# EAGLE design pcb_3 (EAGLE 5.06)
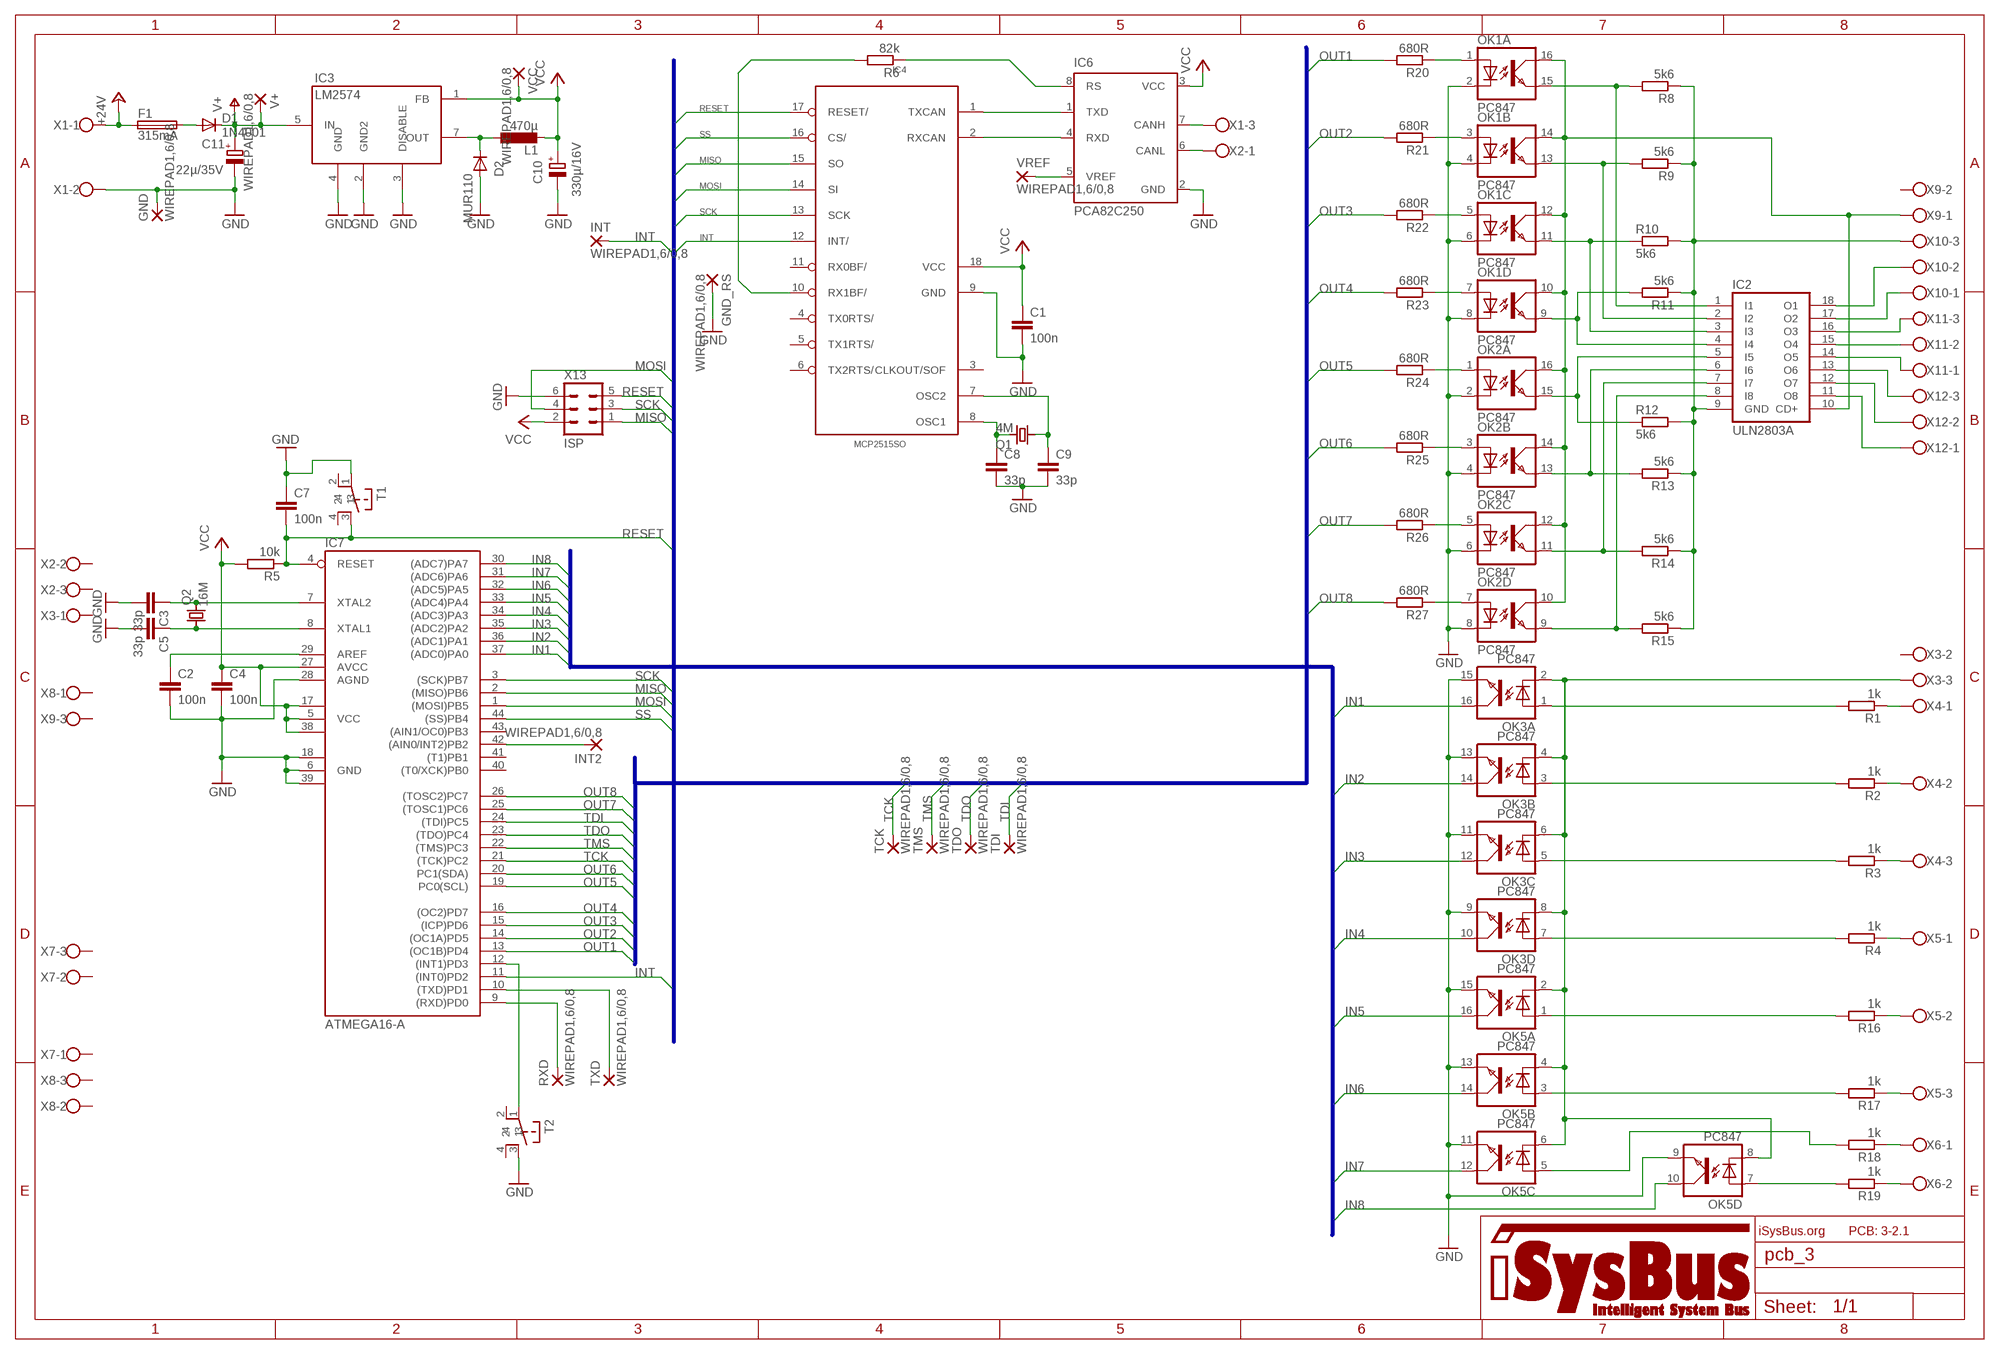
[diagram p0: schematic, sheet 1]

## Parts
C1  100n  C025-025X050  [C025-025X050]
C2  100n  C025-025X050  [C025-025X050]
C3  33p  C025-025X050  [C025-025X050]
C4  100n  C025-025X050  [C025-025X050]
C5  33p  C025-025X050  [C025-025X050]
C7  100n  C025-025X050  [C025-025X050]
C8  33p  C025-025X050  [C025-025X050]
C9  33p  C025-025X050  [C025-025X050]
C10  330µ/16V  CPOLE3.5-8  [E3,5-8]
C11  22µ/35V  CPOLE2-5  [E2-5]
D1  1N4001  [DO41-10]
D2  MUR110  [DO41-10]
F1  315mA  19560  [19560]
GND  WIREPAD1,6/0,8  [1,6/0,8]
GND_RS  WIREPAD1,6/0,8  [1,6/0,8]
IC2  ULN2803A  [DIL18]
IC3  LM2574  LM2574DIL08  [DIL08]
IC4  MCP2515SO  [SO18L]
IC6  PCA82C250  [DIL08]
IC7  ATMEGA16-A  [TQFP44]
INT  WIREPAD1,6/0,8  [1,6/0,8]
INT2  WIREPAD1,6/0,8  [1,6/0,8]
L1  470µ  L-0207/12  [0207/12]
OK1  PC847  [DIL16]
OK2  PC847  [DIL16]
OK3  PC847  [DIL16]
OK5  PC847  [DIL16]
Q1  4M  Q  [HC49U-V]
Q2  16M  Q  [HC49U-V]
R1  1k  R-R0805  [R0805]
R2  1k  R-R0805  [R0805]
R3  1k  R-R0805  [R0805]
R4  1k  R-R0805  [R0805]
R5  10k  R-0207/10  [0207/10]
R6  82k  R-0207/10  [0207/10]
R8  5k6  R-R0805  [R0805]
R9  5k6  R-R0805  [R0805]
R10  5k6  R-R0805  [R0805]
R11  5k6  R-R0805  [R0805]
R12  5k6  R-R0805  [R0805]
R13  5k6  R-R0805  [R0805]
R14  5k6  R-R0805  [R0805]
R15  5k6  R-R0805  [R0805]
R16  1k  R-R0805  [R0805]
R17  1k  R-R0805  [R0805]
R18  1k  R-R0805  [R0805]
R19  1k  R-R0805  [R0805]
R20  680R  R-R0805  [R0805]
R21  680R  R-R0805  [R0805]
R22  680R  R-R0805  [R0805]
R23  680R  R-R0805  [R0805]
R24  680R  R-R0805  [R0805]
R25  680R  R-R0805  [R0805]
R26  680R  R-R0805  [R0805]
R27  680R  R-R0805  [R0805]
RXD  WIREPAD1,6/0,8  [1,6/0,8]
T1  PHAP3301  [PHAP3301]
T2  PHAP3301  [PHAP3301]
TCK  WIREPAD1,6/0,8  [1,6/0,8]
TDI  WIREPAD1,6/0,8  [1,6/0,8]
TDO  WIREPAD1,6/0,8  [1,6/0,8]
TMS  WIREPAD1,6/0,8  [1,6/0,8]
TXD  WIREPAD1,6/0,8  [1,6/0,8]
U$1  ISYSBUS_LOGO  [ISYSBUS_LOGO]
U$2  FIELD_ISB_PLACE  [FIELD_ISB_PLACE]
U$4  3-2.1  FIELD_PCB_PLACE  [FIELD_PCB_PLACE]
V+  WIREPAD1,6/0,8  [1,6/0,8]
VCC  WIREPAD1,6/0,8  [1,6/0,8]
VREF  WIREPAD1,6/0,8  [1,6/0,8]
X1  AKL-03_073-03  [AKL-03]
X2  AKL-03_073-03  [AKL-03]
X3  AKL-03_073-03  [AKL-03]
X4  AKL-03_073-03  [AKL-03]
X5  AKL-03_073-03  [AKL-03]
X6  AKL-02_073-02  [AKL-02]
X7  AKL-03_073-03  [AKL-03]
X8  AKL-03_073-03  [AKL-03]
X9  AKL-03_073-03  [AKL-03]
X10  AKL-03_073-03  [AKL-03]
X11  AKL-03_073-03  [AKL-03]
X12  AKL-03_073-03  [AKL-03]
X13  ISP  ML6  [ML6]

## Nets
+24V: F1.1 X1.1
GND: C1.2 C2.2 C3.2 C4.2 C5.2 C7.1 C8.2 C9.2 C10.- C11.- D2.A GND.1(P) GND_RS.1(P) IC3.2(GND2) IC3.3(DISABLE) IC3.4(GND) IC4.9(GND) IC6.2(GND) IC7.6(GND) IC7.18(GND1) IC7.28(AGND) IC7.39(GND2) OK1.2(A:C) OK1.4(B:C) OK1.6(C:C) OK1.8(D:C) OK2.2(A:C) OK2.4(B:C) OK2.6(C:C) OK2.8(D:C) OK3.9(D:EMIT) OK3.11(C:EMIT) OK3.13(B:EMIT) OK3.15(A:EMIT) OK5.9(D:EMIT) OK5.11(C:EMIT) OK5.13(B:EMIT) OK5.15(A:EMIT) T1.1 T2.3 X1.2 X13.6
GND1: IC2.9(GND) R8.1 R9.1 R10.2 R11.1 R12.2 R13.1 R14.1 R15.1 X10.3
GND2: OK3.2(A:C) OK3.4(B:C) OK3.6(C:C) OK3.8(D:C) OK5.2(A:C) OK5.4(B:C) OK5.6(C:C) OK5.8(D:C) X3.3
IN1: IC7.37((ADC0)PA0) OK3.16(A:COL)
IN2: IC7.36((ADC1)PA1) OK3.14(B:COL)
IN3: IC7.35((ADC2)PA2) OK3.12(C:COL)
IN4: IC7.34((ADC3)PA3) OK3.10(D:COL)
IN5: IC7.33((ADC4)PA4) OK5.16(A:COL)
IN6: IC7.32((ADC5)PA5) OK5.14(B:COL)
IN7: IC7.31((ADC6)PA6) OK5.12(C:COL)
IN8: IC7.30((ADC7)PA7) OK5.10(D:COL)
INT: IC4.12(INT/) IC7.11((INT0)PD2) INT.1(P)
MISO: IC4.15(SO) IC7.2((MISO)PB6) X13.1
MOSI: IC4.14(SI) IC7.1((MOSI)PB5) X13.4
N$1: IC2.14(O5) X11.1
N$2: IC2.13(O6) X12.3
N$3: IC2.12(O7) X12.2
N$4: IC2.11(O8) X12.1
N$5: IC2.15(O4) X11.2
N$6: IC2.16(O3) X11.3
N$7: IC2.17(O2) X10.1
N$8: IC2.18(O1) X10.2
N$9: C5.1 IC7.8(XTAL1) Q2.1
N$10: R19.1 X6.2
N$11: R18.1 X6.1
N$12: OK1.7(D:A) R23.1
N$13: IC2.8(I8) OK2.9(D:EMIT) R15.2
N$14: IC2.7(I7) OK2.11(C:EMIT) R14.2
N$15: IC2.6(I6) OK2.13(B:EMIT) R13.2
N$16: IC2.5(I5) OK2.15(A:EMIT) R12.1
N$17: IC2.4(I4) OK1.9(D:EMIT) R11.2
N$18: D1.A F1.2
N$19: IC2.3(I3) OK1.11(C:EMIT) R10.1
N$20: IC2.2(I2) OK1.13(B:EMIT) R9.2
N$21: IC2.1(I1) OK1.15(A:EMIT) R8.2
N$22: R17.1 X5.3
N$23: R16.1 X5.2
N$24: R4.1 X5.1
N$25: R3.1 X4.3
N$26: R1.1 X4.1
N$27: R2.1 X4.2
N$28: OK5.7(D:A) R19.2
N$29: OK5.5(C:A) R18.2
N$30: OK5.3(B:A) R17.2
N$31: OK5.1(A:A) R16.2
N$32: OK3.7(D:A) R4.2
N$33: OK3.5(C:A) R3.2
N$34: OK3.3(B:A) R2.2
N$35: OK3.1(A:A) R1.2
N$36: C2.1 IC7.29(AREF)
N$37: OK1.5(C:A) R22.1
N$38: OK1.3(B:A) R21.1
N$40: OK1.1(A:A) R20.1
N$41: OK2.1(A:A) R24.1
N$42: OK2.3(B:A) R25.1
N$43: OK2.5(C:A) R26.1
N$44: IC6.7(CANH) X1.3
N$45: IC6.6(CANL) X2.1
N$46: C8.1 IC4.8(OSC1) Q1.2
N$47: IC7.12((INT1)PD3) T2.1
N$48: IC7.42((AIN0/INT2)PB2) INT2.1(P)
N$49: C9.1 IC4.7(OSC2) Q1.1
N$50: IC4.10(RX1BF/) R6.2
N$51: IC7.10((TXD)PD1) TXD.1(P)
N$52: D2.C IC3.7(OUT) L1.1
N$53: IC7.9((RXD)PD0) RXD.1(P)
N$54: IC6.8(RS) R6.1
N$55: C3.1 IC7.7(XTAL2) Q2.2
N$56: IC6.5(VREF) VREF.1(P)
N$62: OK2.7(D:A) R27.1
N$63: IC2.10(CD+) OK1.10(D:COL) OK1.12(C:COL) OK1.14(B:COL) OK1.16(A:COL) OK2.10(D:COL) OK2.12(C:COL) OK2.14(B:COL) OK2.16(A:COL) X9.1
OUT1: IC7.13((OC1B)PD4) R20.2
OUT2: IC7.14((OC1A)PD5) R21.2
OUT3: IC7.15((ICP)PD6) R22.2
OUT4: IC7.16((OC2)PD7) R23.2
OUT5: IC7.19(PC0(SCL)) R24.2
OUT6: IC7.20(PC1(SDA)) R25.2
OUT7: IC7.25((TOSC1)PC6) R26.2
OUT8: IC7.26((TOSC2)PC7) R27.2
RESET: C7.2 IC4.17(RESET/) IC7.4(RESET) R5.1 T1.3 X13.5
RXCAN: IC4.2(RXCAN) IC6.4(RXD)
SCK: IC4.13(SCK) IC7.3((SCK)PB7) X13.3
SS: IC4.16(CS/) IC7.44((SS)PB4)
TCK: IC7.21((TCK)PC2) TCK.1(P)
TDI: IC7.24((TDI)PC5) TDI.1(P)
TDO: IC7.23((TDO)PC4) TDO.1(P)
TMS: IC7.22((TMS)PC3) TMS.1(P)
TXCAN: IC4.1(TXCAN) IC6.1(TXD)
V+: C11.+ D1.C IC3.5(IN) V+.1(P)
VCC: C1.1 C4.1 C10.+ IC3.1(FB) IC4.18(VCC) IC6.3(VCC) IC7.5(VCC) IC7.17(VCC1) IC7.27(AVCC) IC7.38(VCC2) L1.2 R5.2 VCC.1(P) X13.2
Unconnected: IC4.3(CLKOUT/SOF) IC4.4(TX0RTS/) IC4.5(TX1RTS/) IC4.6(TX2RTS/) IC4.11(RX0BF/) IC7.40((T0/XCK)PB0) IC7.41((T1)PB1) IC7.43((AIN1/OC0)PB3) T1.2 T1.4 T2.2 T2.4 X2.2 X2.3 X3.1 X3.2 X7.1 X7.2 X7.3 X8.1 X8.2 X8.3 X9.2 X9.3

## Buses
SCK,MOSI,MISO,SS,RESET,INT
IN[1..8]
OUT[1..8],TDI,TDO,TMS,TCK

## Library data of the parts
C1-C5 C7-C9 = isb_capacitors:C: CAPACITOR, European symbol
C10 C11 = isb_capacitors:CPOL: POLARIZED CAPACITOR, European symbol
D1 = isb_diodes:1N4001
D2 = isb_diodes:MUR110
F1 = isb_supply:19560: FUSE HOLDER TR5, Wickmann
GND GND_RS INT INT2 RXD TCK TDI TDO TMS TXD V+ VCC VREF = isb_connectors:WIREPAD: Wire PAD connect wire on PCB
IC2 = isb_transistors:ULN2803A: DRIVER ARRAY
IC3 = isb_supply:LM2574
IC4 = isb_interfacecontrollers:MCP2515
IC6 = isb_interfacecontrollers:PCA82C250
IC7 = isb_microcontrollers:ATMEGA16
L1 = isb_inductors:L: INDUCTOR, European symbol
OK1-OK3 OK5 = isb_optical:PC847: Optocoupler: PC847 Order numbers (DIP16): - Reichelt: PC 847X - CSD-Electronics: N/A
Q1 Q2 = isb_oscillators:Q
R1-R6 R8-R27 = isb_resistors:R: RESISTOR, European symbol
T1 T2 = isb_buttons:PHAP3301
U$1 = hausbus:ISYSBUS_LOGO
U$2 = isb_misc:FIELD_ISB
U$4 = isb_misc:FIELD_PCB
X1-X5 X7-X12 = isb_connectors:AKL-03_: WAGO SREW CLAMP
X6 = isb_connectors:AKL-02_: WAGO SREW CLAMP
X13 = isb_connectors:ML6: HARTING

## Board
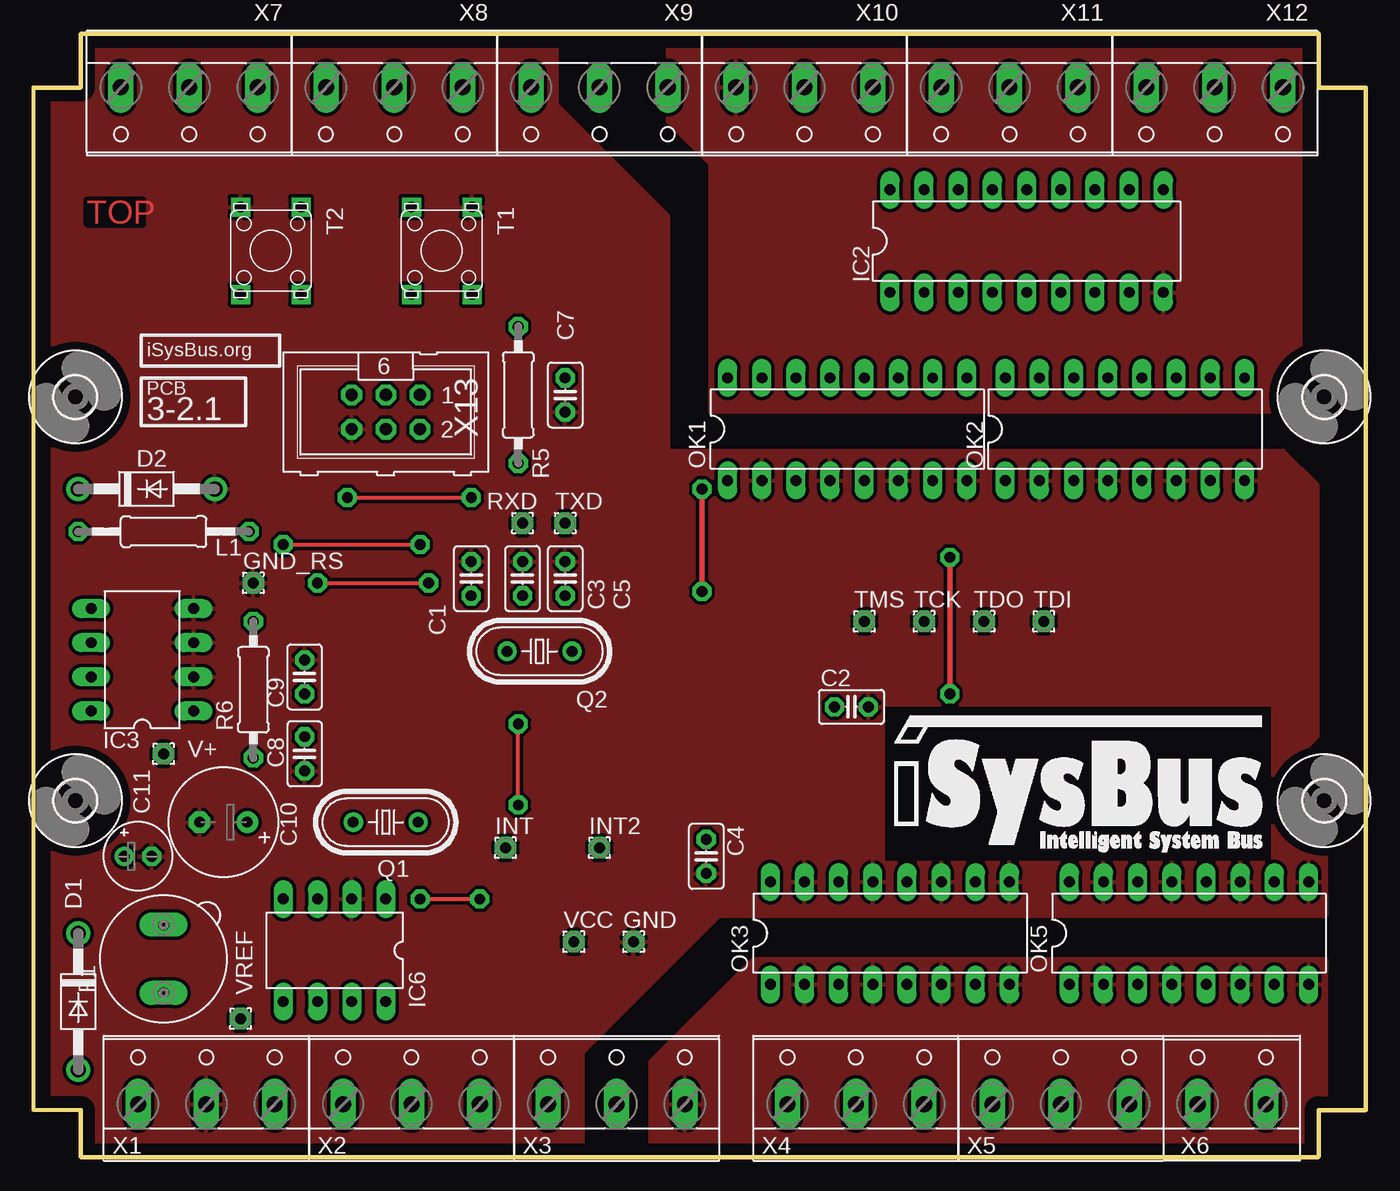
[diagram p1: board, top side]
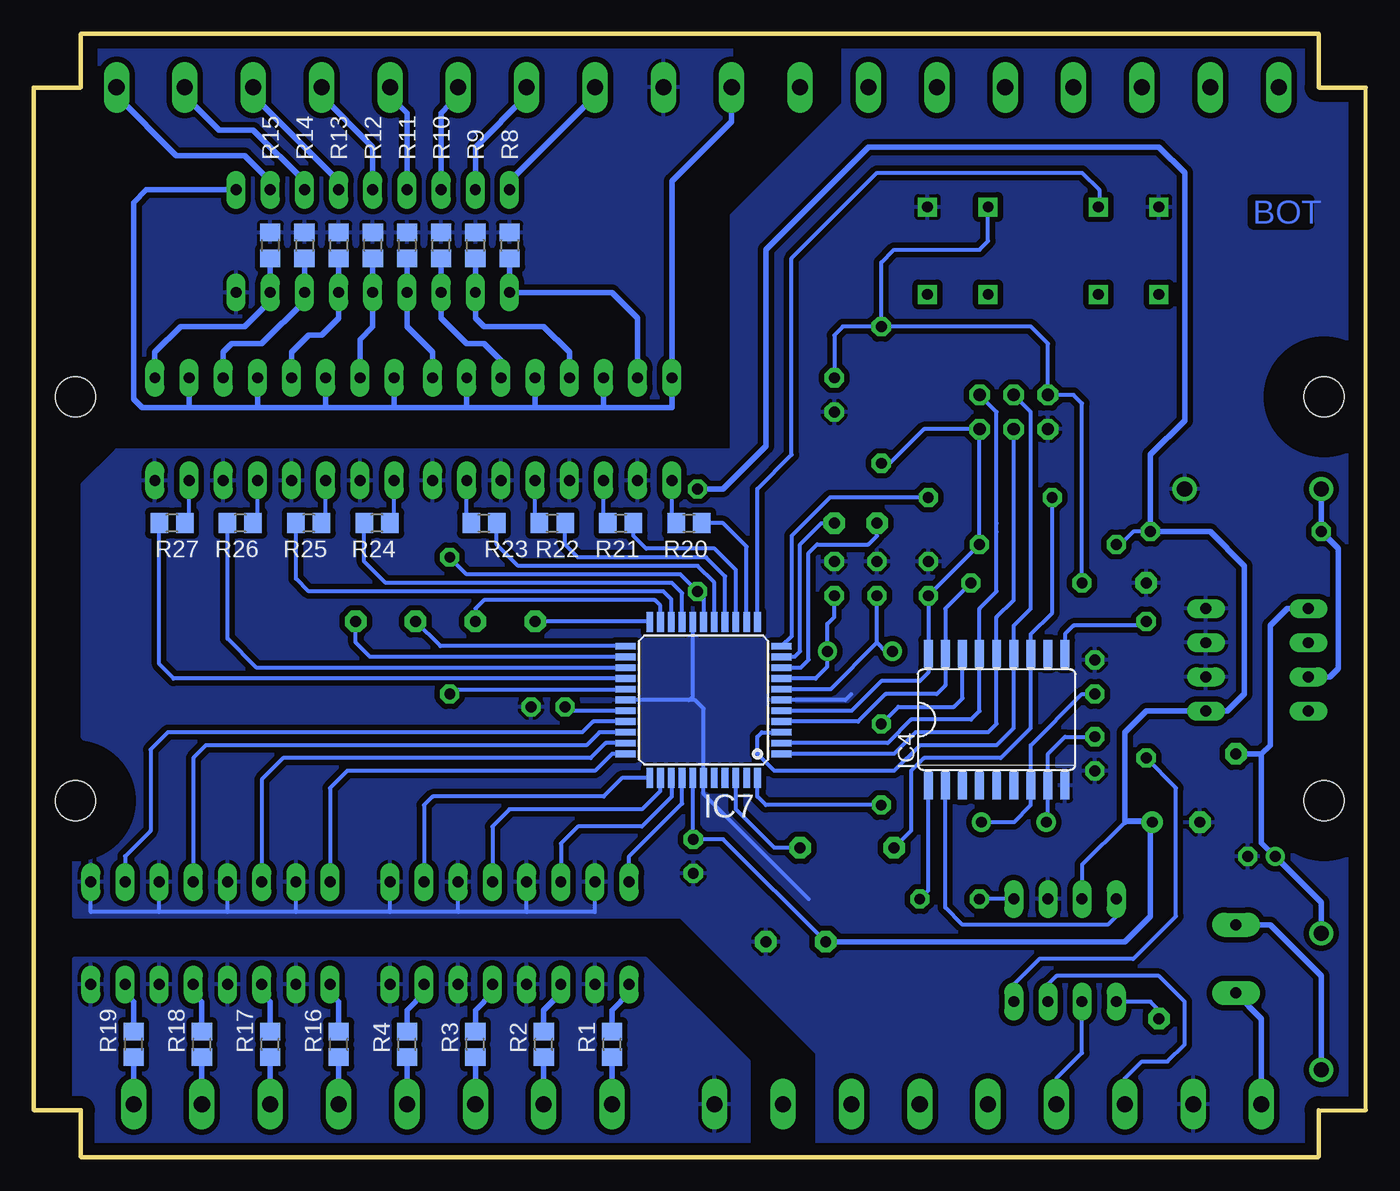
[diagram p2: board, bottom side, seen from below]

Size 99 x 83.5 mm. Coordinates in mm from the lower left corner, seen from the top.
Outline: 3.5,3.5 3.5,0 95.5,0 95.5,3.5 99,3.5 99,79.5 95.5,79.5 95.5,83.5 3.5,83.5 3.5,79.5 0,79.5 0,3.5 3.5,3.5
Copper layers (1*16): Top 0.035mm / dielectric 1.5mm / Bottom 0.035mm
Design rules "hausbus *": minimum track width 12mil, minimum drill 31mil, track to track 10mil, track to pad 10mil, pad to pad 10mil, via to via 10mil, smd to smd 8mil, copper to edge 35mil, drill to drill 8mil, minimum pad ring 12mil, minimum via ring 12mil, stop-mask expansion 6mil, vias tented up to drill 0mil, thermal gap 10mil
tKeepout: area 0,79.5 to 3.5,83.5; area 0,0 to 3.5,3.5
bKeepout: area 0,79.5 to 3.5,83.5; area 0,0 to 3.5,3.5
tRestrict: area 95.5,0 to 99,3.5
bRestrict: area 95.5,0 to 99,3.5
Milling: 12 lines

### Footprints (pad centres in the part's own frame; a part is rotated, then mirrored left to right if it is on the bottom)
C025-025X050 = drill 0.813 octagon: 1 -1.27,0; 2 1.27,0
E3,5-8 = drill 0.813 pad 1.6 round: + -1.778,0 | drill 0.813 pad 1.6 octagon: - 1.778,0
E2-5 = drill 0.813 pad 1.27 round: + -1.016,0 | drill 0.813 pad 1.27 octagon: - 1.016,0
DO41-10 = drill 1.118 round: A 5.08,0; C -5.08,0
19560 = drill 0.813 pad 1.778 long: 1 -2.54,0; 2 2.54,0
1,6/0,8 = drill 0.813 pad 1.6 octagon: 1 0,0
DIL18 = drill 0.813 long: 1 -10.16,-3.81; 2 -7.62,-3.81; 3 -5.08,-3.81; 4 -2.54,-3.81; 5 0,-3.81; 6 2.54,-3.81; 7 5.08,-3.81; 8 7.62,-3.81; 9 10.16,-3.81; 10 10.16,3.81; 11 7.62,3.81; 12 5.08,3.81; 13 2.54,3.81; 14 0,3.81; 15 -2.54,3.81; 16 -5.08,3.81; 17 -7.62,3.81; 18 -10.16,3.81
DIL08 = drill 0.813 long: 1 -3.81,-3.81; 2 -1.27,-3.81; 3 1.27,-3.81; 4 3.81,-3.81; 5 3.81,3.81; 6 1.27,3.81; 7 -1.27,3.81; 8 -3.81,3.81
SO18L = smd 0.66 x 2.032: 1 -5.08,-4.902; 2 -3.81,-4.902; 3 -2.54,-4.902; 4 -1.27,-4.902; 5 0,-4.902; 6 1.27,-4.902; 7 2.54,-4.902; 8 3.81,-4.902; 9 5.08,-4.902; 10 5.08,4.902; 11 3.81,4.902; 12 2.54,4.902; 13 1.27,4.902; 14 0,4.902; 15 -1.27,4.902; 16 -2.54,4.902; 17 -3.81,4.902; 18 -5.08,4.902
TQFP44 = smd 1.5 x 0.5: 1 -5.8,4; 2 -5.8,3.2; 3 -5.8,2.4; 4 -5.8,1.6; 5 -5.8,0.8; 6 -5.8,0; 7 -5.8,-0.8; 8 -5.8,-1.6; 9 -5.8,-2.4; 10 -5.8,-3.2; 11 -5.8,-4; 23 5.8,-4; 24 5.8,-3.2; 25 5.8,-2.4; 26 5.8,-1.6; 27 5.8,-0.8; 28 5.8,0; 29 5.8,0.8; 30 5.8,1.6; 31 5.8,2.4; 32 5.8,3.2; 33 5.8,4 | smd 0.5 x 1.5: 12 -4,-5.8; 13 -3.2,-5.8; 14 -2.4,-5.8; 15 -1.6,-5.8; 16 -0.8,-5.8; 17 0,-5.8; 18 0.8,-5.8; 19 1.6,-5.8; 20 2.4,-5.8; 21 3.2,-5.8; 22 4,-5.8; 34 4,5.8; 35 3.2,5.8; 36 2.4,5.8; 37 1.6,5.8; 38 0.8,5.8; 39 0,5.8; 40 -0.8,5.8; 41 -1.6,5.8; 42 -2.4,5.8; 43 -3.2,5.8; 44 -4,5.8
0207/12 = drill 0.813 octagon: 1 -6.35,0; 2 6.35,0
DIL16 = drill 0.813 long: 1 -8.89,-3.81; 2 -6.35,-3.81; 3 -3.81,-3.81; 4 -1.27,-3.81; 5 1.27,-3.81; 6 3.81,-3.81; 7 6.35,-3.81; 8 8.89,-3.81; 9 8.89,3.81; 10 6.35,3.81; 11 3.81,3.81; 12 1.27,3.81; 13 -1.27,3.81; 14 -3.81,3.81; 15 -6.35,3.81; 16 -8.89,3.81
HC49U-V = drill 0.813 round: 1 -2.413,0; 2 2.413,0
R0805 = smd 1.3 x 1.5: 1 -0.95,0; 2 0.95,0
0207/10 = drill 0.813 octagon: 1 -5.08,0; 2 5.08,0
PHAP3301 = drill 0.8 square: 1 0,4.5; 2 6.5,4.5; 3 0,0; 4 6.5,0
3,0 = hole 3: 0,0
AKL-03 = drill 1.194 long: 1 -5.08,-0.635; 2 0,-0.635; 3 5.08,-0.635
AKL-02 = drill 1.194 long: 1 -2.54,-0.635; 2 2.54,-0.635
ML6 = drill 0.914 octagon: 1 -2.54,-1.27; 2 -2.54,1.27; 3 0,-1.27; 4 0,1.27; 5 2.54,-1.27; 6 2.54,1.27

### Placement (x,y rotation side)
C1  32.52,43 90 top
C2  60.78,33.47 0 top
C3  36.33,43 90 top
C4  49.98,22.36 270 top
C5  39.51,43 90 top
C7  39.51,56.65 90 top
C8  20.14,29.98 270 top
C9  20.14,35.7 90 top
C10  14.11,24.9 180 top
C11  7.76,22.36 0 top
D1  3.31,11.56 270 top
D2  8.39,49.66 0 top
F1  9.66,14.74 90 top
GND  44.59,16.01 0 top
GND_RS  16.33,42.68 0 top
IC2  73.8,68.08 0 top
IC3  8.07,36.97 90 top
IC4  27.44,32.52 0 bottom
IC6  22.36,15.38 180 top
IC7  49.22,33.98 180 bottom
INT  35.06,23 0 top
INT2  42.05,23 0 top
L1  9.66,46.49 0 top
OK1  60.46,54.11 0 top
OK2  81.1,54.11 0 top
OK3  63.64,16.64 0 top
OK5  85.86,16.64 0 top
Q1  26.17,24.9 180 top
Q2  37.6,37.6 180 top
R1  56.02,8.39 90 bottom
R2  61.09,8.39 90 bottom
R3  66.17,8.39 90 bottom
R4  71.25,8.39 90 bottom
R5  36.01,56.65 270 top
R6  16.33,34.74 90 top
R8  63.64,67.76 270 bottom
R9  66.17,67.76 270 bottom
R10  68.72,67.76 90 bottom
R11  71.25,67.76 270 bottom
R12  73.8,67.76 90 bottom
R13  76.33,67.76 270 bottom
R14  78.88,67.76 270 bottom
R15  81.42,67.76 270 bottom
R16  76.33,8.39 90 bottom
R17  81.42,8.39 90 bottom
R18  86.5,8.39 90 bottom
R19  91.58,8.39 90 bottom
R20  50.3,47.12 0 bottom
R21  55.38,47.12 0 bottom
R22  60.46,47.12 0 bottom
R23  65.54,47.12 0 bottom
R24  73.48,47.12 180 bottom
R25  78.56,47.12 180 bottom
R26  83.64,47.12 180 bottom
R27  88.72,47.12 180 bottom
RXD  36.33,47.12 0 top
T1  28.07,70.62 270 top
T2  15.38,70.62 270 top
TCK  66.17,39.82 0 top
TDI  75.06,39.82 0 top
TDO  70.62,39.82 0 top
TMS  61.73,39.82 0 top
TXD  39.51,47.12 0 top
U$1  63.95,22.68 0 top
U$2  8.39,57.92 0 top
U$3  [3,0]  3.1,56.5 0 top
U$4  8.39,54.74 0 top
U$5  [3,0]  3.1,26.5 0 top
U$6  [3,0]  95.9,56.5 0 top
U$7  [3,0]  95.9,26.5 0 top
V+  9.66,29.98 0 top
VCC  40.14,16.01 0 top
VREF  15.38,10.29 0 top
X1  12.84,4.58 0 top
X2  28.07,4.58 0 top
X3  43.31,4.58 0 top
X4  61.09,4.58 0 top
X5  76.33,4.58 0 top
X6  89.03,4.58 0 top
X7  11.56,78.88 180 top
X8  26.8,78.88 180 top
X9  42.05,78.88 180 top
X10  57.28,78.88 180 top
X11  72.53,78.88 180 top
X12  87.77,78.88 180 top
X13  26.17,55.38 180 top

### Tracks (layer width: path | path; a pad name or v marks a point on that pad's centre or on a via)
+24V
  Bottom 0.406: X1.1 7.76,10.29 F1.1
GND
  Bottom 0.305: 89.67,18.23 94.75,18.23 OK5.9 94.75,21.73 | 89.67,18.23 OK5.11 | 84.59,18.23 89.67,18.23 | 84.59,18.23 OK5.13 | 79.51,18.23 84.59,18.23 | 79.51,21.09 OK5.15 79.51,18.23 | 72.53,18.23 79.51,18.23 | 72.53,18.23 OK3.9 | 67.44,18.23 72.53,18.23 | 67.44,18.23 OK3.11 | 62.37,18.23 67.44,18.23 | 62.37,18.23 OK3.13 | 62.37,18.23 57.28,18.23 OK3.15 | IC4.9 22.36,28.07 | IC7.6 38.68,33.98 38.23,34.42 | 50.3,33.98 49.85,33.98 49.22,33.34 IC7.39 49.22,26.99 41.41,19.18 | 50.3,33.98 IC7.28 | IC7.18 50.02,34.26 50.3,33.98
  pour Bottom (isolate 0.406): 1.41,82.69 38.87,82.69 38.87,78.24 47.12,69.98 47.12,52.52 92.84,52.52 95.39,49.98 95.39,31.25 93.48,29.34 93.48,24.9 96.02,22.36 96.02,17.91 50.94,17.91 40.77,7.76 40.77,0.77 1.41,0.77
  pour Top: 1.41,82.69 38.87,82.69 38.87,78.24 47.12,69.98 47.12,52.52 92.84,52.52 95.39,49.98 95.39,31.25 93.48,29.34 93.48,24.9 96.02,22.36 96.02,17.91 50.94,17.91 40.77,7.76 40.77,0.77 1.41,0.77
GND1
  pour Bottom (isolate 0.406): 47.12,82.69 94.11,82.69 94.11,55.38 50.3,55.38 50.3,73.8 47.12,76.97
  pour Top: 47.12,82.69 94.11,82.69 94.11,55.38 50.3,55.38 50.3,73.8 47.12,76.97
GND2
  pour Bottom (isolate 0.406): 45.85,0.77 45.85,7.12 53.48,14.74 96.02,14.74 96.02,0.77
  pour Top: 45.85,0.77 45.85,7.12 53.48,14.74 96.02,14.74 96.02,0.77
IN1
  Bottom 0.305: OK3.16 54.74,22.36 50.82,26.29 IC7.37
IN2
  Bottom 0.305: IC7.36 51.57,28.18 51.57,26.8 53.79,24.58 58.55,24.58 59.83,23.31 OK3.14
IN3
  Bottom 0.305: IC7.35 52.42,27.23 53.79,25.85 63.64,25.85 64.91,24.58 OK3.12
IN4
  Bottom 0.305: IC7.34 55.28,28.18 56.65,26.8 69.35,26.8 69.98,26.17 OK3.10
IN5
  Bottom 0.305: IC7.33 54.75,29.98 54.74,29.98 56.02,29.98 57.28,28.71 75.7,28.71 76.97,27.44 OK5.16
IN6
  Bottom 0.305: OK5.14 82.05,28.07 80.46,29.66 57.6,29.66 56.49,30.78 IC7.32
IN7
  Bottom 0.305: OK5.12 87.13,29.66 86.17,30.62 86.16,30.61 57.92,30.61 56.96,31.58 IC7.31
IN8
  Bottom 0.305: OK5.10 92.21,22.36 90.31,24.27 90.31,30.3 89.03,31.57 58.24,31.57 57.43,32.38 IC7.30
INT  (via drill 0.8)
  Top 0.305: v23.31,49.03 v32.52,49.03
  Bottom 0.305: v32.52,49.03 39.82,49.03 42.68,46.17 42.68,38.71 IC7.11 | INT.1 33.79,24.27 33.79,28.71 32.84,29.66 27.12,29.66 24.9,31.88 IC4.12 24.9,38.87 23.31,40.46 v23.31,49.03
MISO
  Bottom 0.305: 27.44,46.49 27.44,47.12 | X13.1 27.44,55.38 27.44,46.49 | IC7.2 35.53,30.78 33.79,32.52 29.34,32.52 28.71,33.16 IC4.15 28.71,40.77 27.44,42.05 27.44,46.49
MOSI
  Bottom 0.305: X13.4 26.17,41.41 27.44,40.14 IC4.14 27.44,32.2 28.07,31.57 33.47,31.57 35.06,29.98 37.6,29.98 IC7.1
N$1
  Bottom 0.406: IC2.14 73.8,75.06 77.61,78.88 X11.1
N$2
  Bottom 0.406: IC2.13 76.33,72.53 82.69,78.88 X12.3
N$3
  Bottom 0.406: IC2.12 78.88,72.53 82.69,76.33 85.22,76.33 87.77,78.88 X12.2
N$4
  Bottom 0.406: IC2.11 81.42,72.53 83.32,74.43 88.4,74.43 92.84,78.88 X12.1
N$5
  Bottom 0.305: 72.53,78.88 X11.2
  Bottom 0.406: IC2.15 71.25,77.61 72.53,78.88
N$6
  Bottom 0.406: IC2.16 68.72,77.61 68.08,78.24 68.08,78.88 X11.3
N$7
  Bottom 0.406: IC2.17 66.17,75.06 62.37,78.88 X10.1
N$8
  Bottom 0.406: IC2.18 63.64,72.53 57.28,78.88 X10.2
N$9
  Bottom 0.305: IC7.8 40.89,35.58 40.01,36.46 Q2.1 40.01,39.63 39.51,40.14 C5.1
N$10
  Bottom 0.305: R19.1 91.58,7.76
  Bottom 0.406: X6.2 R19.1
N$11
  Bottom 0.406: X6.1 R18.1
N$12
  Bottom 0.305: R23.1 66.81,47.45 OK1.7
N$13
  Bottom 0.406: R15.2 IC2.8 81.42,63.64 83.32,61.73 88.08,61.73 89.99,59.83 OK2.9
N$14
  Bottom 0.406: R14.2 IC2.7 78.88,63.64 82.05,60.46 84.27,60.46 84.91,59.83 OK2.11
N$15
  Bottom 0.406: R13.2 IC2.6 76.33,62.37 77.61,61.09 78.56,61.09 79.83,59.83 OK2.13
N$16
  Bottom 0.406: R12.1 IC2.5 73.8,61.73 74.75,60.78 OK2.15
N$17
  Bottom 0.406: IC2.4 71.25,63.64 | IC2.4 R11.2 | OK1.9 69.35,59.83 71.25,61.73 IC2.4
N$18
  Bottom 0.406: F1.2 7.12,17.28 3.31,13.47 D1.A
N$19
  Bottom 0.406: IC2.3 68.72,63.64 | IC2.3 R10.1 | IC2.3 68.72,62.37 66.81,60.46 65.54,60.46 64.27,59.19 OK1.11
N$20
  Bottom 0.406: R9.2 IC2.2 66.17,62.37 65.54,61.73 61.09,61.73 59.19,59.83 OK1.13
N$21
  Bottom 0.406: R8.2 IC2.1 56.02,64.27 54.11,62.37 OK1.15
N$22
  Bottom 0.406: X5.3 R17.1
N$23
  Bottom 0.406: X5.2 R16.1
N$24
  Bottom 0.406: X5.1 R4.1
N$25
  Bottom 0.406: X4.3 R3.1
N$26
  Bottom 0.406: X4.1 R1.1
N$27
  Bottom 0.406: X4.2 R2.1
N$28
  Bottom 0.406: R19.2 91.58,11.56 92.21,12.2 OK5.7
N$29
  Bottom 0.406: R18.2 86.5,11.56 87.13,12.2 OK5.5
N$30
  Bottom 0.406: R17.2 81.42,11.56 82.05,12.2 OK5.3
N$31
  Bottom 0.406: R16.2 76.33,11.56 76.97,12.2 OK5.1
N$32
  Bottom 0.406: R4.2 71.25,10.93 69.98,12.2 OK3.7
N$33
  Bottom 0.406: R3.2 66.17,10.93 64.91,12.2 OK3.5
N$34
  Bottom 0.406: R2.2 61.09,10.93 59.83,12.2 OK3.3
N$35
  Bottom 0.406: R1.2 56.02,10.93 54.74,12.2 OK3.1
N$36
  Bottom 0.305: C2.1 59.21,33.18 IC7.29
N$37
  Bottom 0.305: R22.1 61.73,47.45 OK1.5
N$38
  Bottom 0.305: R21.1 56.65,47.45 OK1.3
N$40
  Bottom 0.305: R20.1 51.57,47.45 OK1.1
N$41
  Bottom 0.305: R24.1 72.21,47.45 OK2.1
N$42
  Bottom 0.305: R25.1 77.29,47.45 OK2.3
N$43
  Bottom 0.305: R26.1 82.37,47.45 OK2.5
N$44
  Bottom 0.305: X1.3 17.91,5.85 16.64,7.12 14.74,7.12 13.47,8.39 13.47,11.56 15.38,13.47 23,13.47 23.63,12.84 IC6.7
N$45
  Bottom 0.305: X2.1 23,5.85 21.09,7.76 IC6.6
N$46
  Bottom 0.305: Q1.2 23.76,25.41 23.63,25.54 IC4.8 23.63,29.98 22.36,31.25 C8.1
N$47
  Bottom 0.305: IC7.12 45.22,49.66 42.68,52.2 42.68,66.81 36.33,73.16 21.09,73.16 19.82,71.89 19.82,70.62 T2.1
N$48
  Bottom 0.305: IC7.42 46.82,25.86 43.95,23 INT2.1
N$49
  Bottom 0.305: Q1.1 26.17,24.9 24.9,26.17 IC4.7 24.9,30.61 21.09,34.42 C9.1
N$50
  Bottom 0.305: IC4.10 22.36,38.87 21.73,39.51 16.33,39.51 R6.2
N$51
  Bottom 0.305: IC7.10 42.47,37.18 42.05,37.6 42.05,45.54 40.46,47.12 TXD.1
N$52
  Bottom 0.406: IC3.7 2.67,35.7 2.04,36.33 2.04,45.22 L1.1 D2.C
N$53
  Bottom 0.305: IC7.9 42,36.38 41.41,36.97 41.41,44.9 40.77,45.54 36.97,45.54 36.33,46.17 RXD.1
N$54
  Bottom 0.305: IC6.8 26.17,12.84 24.27,14.74 17.28,14.74 14.11,17.91 14.11,27.44 R6.1
N$55
  Bottom 0.305: IC7.7 39.79,34.78 36.33,38.23 | Q2.2 35.7,37.6 36.33,38.23 | 36.33,38.23 C3.1
N$56
  Bottom 0.305: VREF.1 15.38,10.93 16.01,11.56 IC6.5
N$62
  Bottom 0.305: R27.1 87.45,47.45 OK2.7
N$63
  Bottom 0.406: 77.29,55.7 82.37,55.7 | 87.45,55.7 OK2.10 | 77.29,55.7 OK2.14 | 72.21,55.7 77.29,55.7 | 72.21,55.7 OK2.16 | 66.81,55.7 72.21,55.7 | 66.81,55.7 OK1.10 | 61.73,55.7 66.81,55.7 | 61.73,55.7 OK1.12 | 56.65,55.7 61.73,55.7 | 56.65,55.7 OK1.14 | 56.65,55.7 51.57,55.7 OK1.16 51.57,72.53 47.12,76.97 X9.1 | 82.37,55.7 OK2.12 | 82.37,55.7 87.45,55.7 | IC2.10 90.62,71.89 91.58,70.94 91.58,56.33 90.94,55.7 87.45,55.7
OUT1
  Bottom 0.305: IC7.13 46.02,45.38 47.76,47.12 R20.2
OUT2
  Bottom 0.305: IC7.14 46.82,43.64 48.4,45.22 53.48,45.22 54.43,46.17 R21.2
OUT3
  Bottom 0.305: IC7.15 47.62,43.17 49.03,44.59 58.55,44.59 59.51,45.54 R22.2
OUT4
  Bottom 0.305: IC7.16 48.42,42.7 49.66,43.95 63,43.95 64.59,45.54 R23.2
OUT5
  Bottom 0.305: IC7.19 50.82,41.93 51.57,42.68 72.84,42.68 74.43,44.27 R24.2
OUT6
  Bottom 0.305: IC7.20 51.62,41.46 52.2,42.05 78.56,42.05 79.51,42.99 R25.2
OUT7
  Bottom 0.305: IC7.25 82.41,36.38 84.59,38.55 R26.2
OUT8
  Bottom 0.305: IC7.26 88.6,35.58 89.67,36.65 R27.2
RESET  (via drill 0.8)
  Top 0.305: v21.09,42.68 v29.34,42.68
  Bottom 0.305: IC7.4 37.74,32.38 35.7,34.42 31.88,34.42 31.25,35.06 IC4.17 31.25,40.77 v29.34,42.68 | R5.1 36.01,66.49 35.06,67.44 28.71,67.44 28.07,68.08 T1.3 | v21.09,42.68 21.09,56.02 21.73,56.65 X13.5 23.63,60.46 24.9,61.73 R5.1 | R5.1 38.87,61.73 39.51,61.09 C7.2
RXCAN
  Bottom 0.305: IC6.4 18.55,17.91 19.18,17.28 29.98,17.28 31.25,18.55 IC4.2
SCK
  Bottom 0.305: X13.3 24.9,55.38 24.9,40.77 26.17,39.51 IC4.13 26.17,31.88 27.44,30.61 33.16,30.61 35.06,28.71 43.95,28.71 45.22,29.98 45.22,31.25 44.89,31.58 IC7.3
SS  (via drill 0.8)
  Top 0.305: v36.01,26.17 v36.01,32.2
  Bottom 0.305: IC7.44 45.22,26.8 44.59,26.17 v36.01,26.17 | IC4.16 29.98,34.11 30.61,33.47 34.74,33.47 v36.01,32.2
TCK
  Bottom 0.305: IC7.21 52.42,40.99 52.84,41.41 65.54,41.41 66.17,40.77 TCK.1
TDI
  Bottom 0.305: IC7.24 74.01,37.18 75.06,38.23 TDI.1
TDO
  Bottom 0.305: IC7.23 68.77,37.98 TDO.1
TMS
  Bottom 0.305: TMS.1 53.26,39.82 IC7.22
TXCAN  (via drill 0.8)
  Top 0.305: v28.71,19.18 v33.16,19.18
  Bottom 0.305: IC6.1 v28.71,19.18 | v33.16,19.18 32.52,19.82 IC4.1
V+
  Bottom 0.406: IC3.5 5.85,40.77 7.12,39.51 7.12,30.61 7.76,29.98 | D1.C 3.31,18.93 C11.+ 7.76,23.38 7.76,29.98 | 7.76,29.98 V+.1
VCC  (via drill 0.8)
  Top 0.305: v18.55,45.54 v28.71,45.54
  Top 0.406: v68.08,44.59 v68.08,34.42 | v49.66,49.66 v49.66,42.05
  Bottom 0.305: 21.09,20.45 IC6.3 21.09,21.73 17.91,24.9 | 49.98,28.07 50.02,28.11 IC7.38 50.02,23.66 C4.1 47.76,23.63 VCC.1 | 17.91,24.9 C10.+ 15.88,25.03 17.79,25.03 17.91,24.9 | IC7.17 49.22,41.6 v49.66,42.05 50.94,43.31 66.81,43.31 v68.08,44.59 | IC7.5 38.21,33.18 36.01,35.38 33.16,35.38 32.52,36.01 IC4.18 C1.1 v28.71,45.54 X13.2 32.84,54.11 35.38,51.57 R5.2 | IC7.27 67.73,34.78 v68.08,34.42 | v18.55,45.54 18.23,45.54 17.28,46.49 L1.2
  Bottom 0.406: C10.+ 16.01,24.9 16.01,17.91 17.91,16.01 VCC.1 | 17.91,24.9 17.91,31.57 16.33,33.16 IC3.1 10.29,33.16 9.03,34.42 9.03,43.95 11.56,46.49 L1.2 16.01,52.2 13.47,54.74 13.47,73.16 15.38,75.06 36.97,75.06 44.59,67.44 44.59,52.84 47.76,49.66 v49.66,49.66

### Text on the board
Top: TOP
Bottom: BOT
tDocu: IDENTIFY | RESET | PWR | CAN